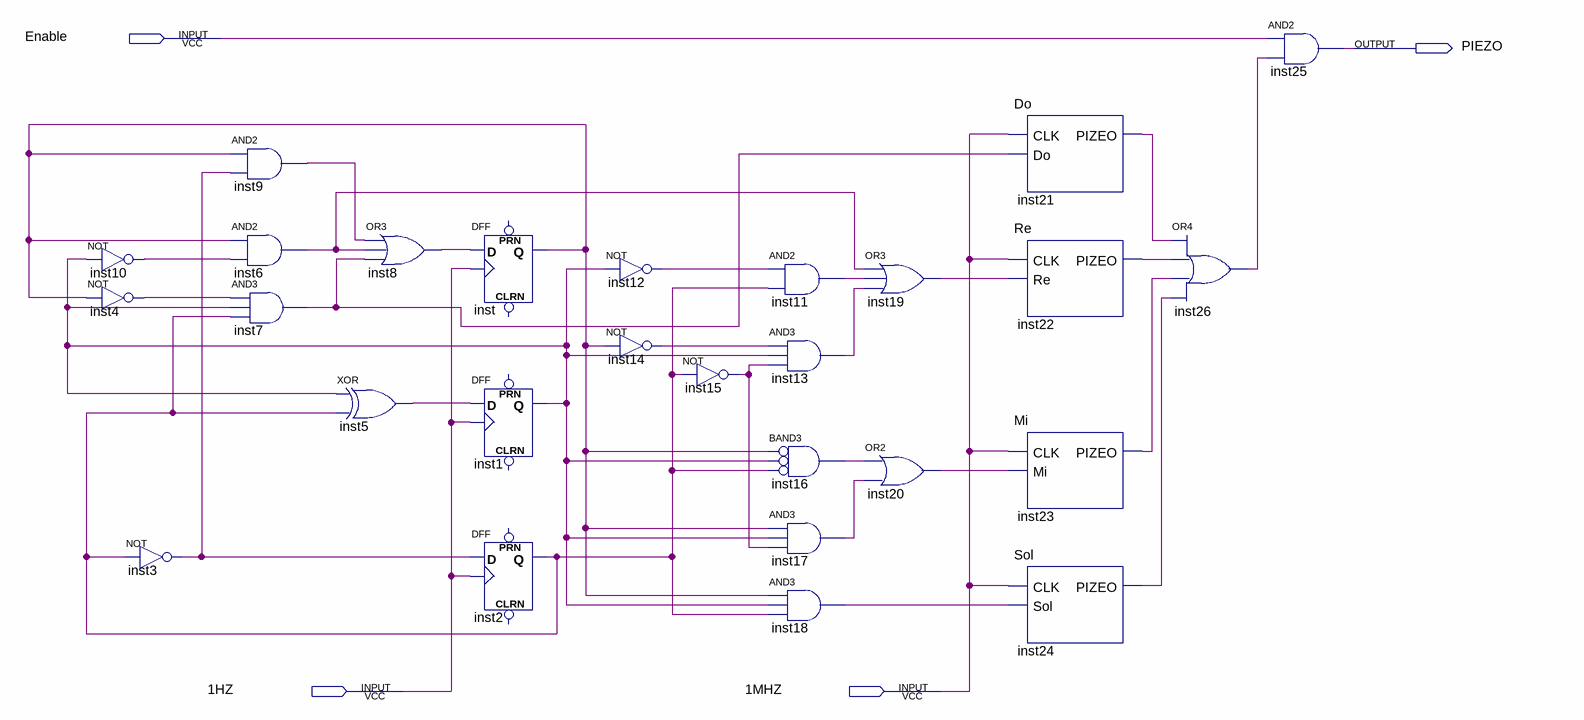
[diagram p0: schematic sheet]
// Quartus schematic PIEZOprint.bdf as structural Verilog: 27 symbols, 4 pins
module PIEZOprint (
  input  Enable,
  input  \1HZ ,
  input  \1MHZ ,
  output PIEZO
);

  wire inst1_q, inst2_q, inst3_out, inst4_out, inst5_out, inst6_out, inst7_out, inst8_out, inst9_out,
       inst10_out, inst11_out, inst12_out, inst13_out, inst14_out, inst15_out, inst16_out, inst17_out,
       inst18_out, inst19_out, inst20_out, inst21_pizeo, inst22_pizeo, inst23_pizeo, inst24_pizeo,
       inst26_out, inst_q;

  not inst10 (inst10_out, inst1_q);
  not inst4 (inst4_out, inst_q);
  not inst3 (inst3_out, inst2_q);
  and inst9 (inst9_out, inst_q, inst3_out);
  and inst6 (inst6_out, inst_q, inst10_out);
  and inst7 (inst7_out, inst4_out, inst1_q, inst2_q);
  or inst8 (inst8_out, inst9_out, inst6_out, inst7_out);
  xor inst5 (inst5_out, inst1_q, inst2_q);
  DFF inst (.CLK(\1HZ ), .D(inst8_out), .Q(inst_q));  // open: CLRN, PRN
  DFF inst1 (.CLK(\1HZ ), .D(inst5_out), .Q(inst1_q));  // open: CLRN, PRN
  DFF inst2 (.CLK(\1HZ ), .D(inst3_out), .Q(inst2_q));  // open: CLRN, PRN
  not inst12 (inst12_out, inst1_q);
  not inst14 (inst14_out, inst_q);
  not inst15 (inst15_out, inst2_q);
  and inst11 (inst11_out, inst12_out, inst2_q);
  and inst13 (inst13_out, inst14_out, inst1_q, inst15_out);
  and inst16 (inst16_out, ~inst_q, ~inst1_q, ~inst2_q);  // BAND3
  and inst17 (inst17_out, inst_q, inst1_q, inst15_out);
  and inst18 (inst18_out, inst_q, inst1_q, inst2_q);
  or inst19 (inst19_out, inst6_out, inst11_out, inst13_out);
  or inst20 (inst20_out, inst16_out, inst17_out);
  Do inst21 (.CLK(\1MHZ ), .Do(inst7_out), .PIZEO(inst21_pizeo));
  Re inst22 (.CLK(\1MHZ ), .Re(inst19_out), .PIZEO(inst22_pizeo));
  Mi inst23 (.CLK(\1MHZ ), .Mi(inst20_out), .PIZEO(inst23_pizeo));
  Sol inst24 (.CLK(\1MHZ ), .Sol(inst18_out), .PIZEO(inst24_pizeo));
  or inst26 (inst26_out, inst21_pizeo, inst22_pizeo, inst23_pizeo, inst24_pizeo);
  and inst25 (PIEZO, Enable, inst26_out);
endmodule
